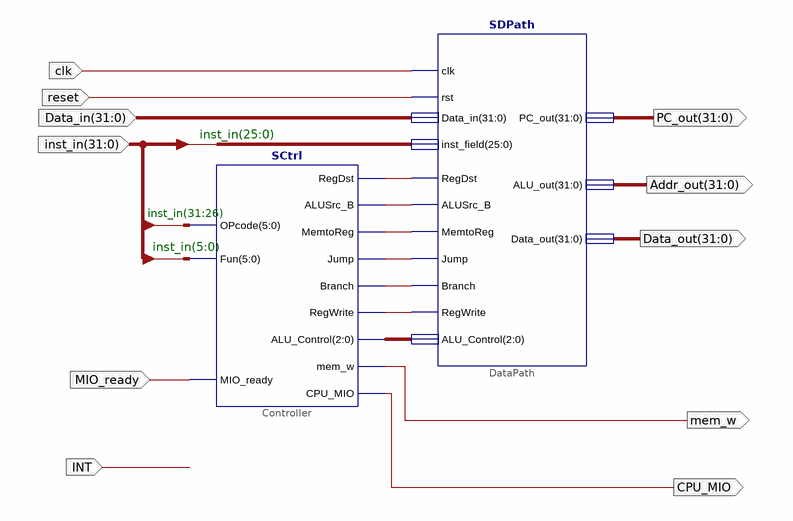
[diagram p0: schematic sheet 1]
// Xilinx ISE schematic SCPU.sch (kintex7) as structural Verilog: 2 symbols, 11 ports
module SCPU (
  input  clk,
  input  INT,
  input  [31:0] inst_in,
  input  reset,
  input  MIO_ready,
  input  [31:0] Data_in,
  output CPU_MIO,
  output mem_w,
  output [31:0] PC_out,
  output [31:0] Addr_out,
  output [31:0] Data_out
);

  wire XLXN_2, XLXN_3, XLXN_4, XLXN_5, XLXN_6, XLXN_8;
  wire [2:0] XLXN_7;

  SDPath #(.VeriModel("SDPath")) DataPath (
    .RegDst(XLXN_2), .ALUSrc_B(XLXN_3), .MemtoReg(XLXN_4), .Jump(XLXN_5), .Branch(XLXN_6), .RegWrite(XLXN_8),
    .ALU_Control(XLXN_7), .Data_in(Data_in), .inst_field(inst_in[25:0]), .clk(clk), .rst(reset),
    .PC_out(PC_out), .ALU_out(Addr_out), .Data_out(Data_out));
  SCtrl Controller (
    .RegDst(XLXN_2), .ALUSrc_B(XLXN_3), .MemtoReg(XLXN_4), .Jump(XLXN_5), .Branch(XLXN_6), .RegWrite(XLXN_8),
    .ALU_Control(XLXN_7), .CPU_MIO(CPU_MIO), .mem_w(mem_w), .Fun(inst_in[5:0]), .MIO_ready(MIO_ready),
    .OPcode(inst_in[31:26]));

  // Notes on the sheet:
  //   inst_in(25:0)
  //   inst_in(31:26)
  //   inst_in(5:0)
endmodule
